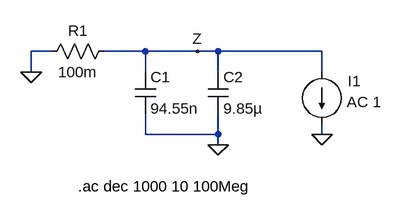
[diagram p0: schematic Draft1.asc]
Draft1.asc, the LTspice schematic file:
Version 4
SHEET 1 1128 680
WIRE -16 128 -48 128
WIRE 128 128 64 128
WIRE 208 128 128 128
WIRE 240 128 208 128
WIRE 400 128 240 128
WIRE -48 160 -48 128
WIRE 128 160 128 128
WIRE 240 160 240 128
WIRE 400 160 400 128
WIRE 128 256 128 224
WIRE 240 256 240 224
WIRE 240 256 128 256
WIRE 400 256 400 240
WIRE 240 272 240 256
FLAG 240 272 0
FLAG 208 128 Z
FLAG 400 256 0
FLAG -48 160 0
SYMBOL cap 112 160 R0
SYMATTR InstName C1
SYMATTR Value 94.55n
SYMATTR SpiceLine Rser=25.1m Lser=381p
SYMBOL cap 224 160 R0
SYMATTR InstName C2
SYMATTR Value 9.85µ
SYMATTR SpiceLine Rser=3m Lser=1.2n
SYMBOL current 400 160 R0
WINDOW 0 40 14 Left 2
WINDOW 3 38 46 Left 2
SYMATTR InstName I1
SYMATTR Value AC 1
SYMBOL res 80 112 R90
WINDOW 0 0 56 VBottom 2
WINDOW 3 32 56 VTop 2
SYMATTR InstName R1
SYMATTR Value 100m
TEXT 24 336 Left 2 !.ac dec 1000 10 100Meg

The netlist it stands for:
* Draft1.asc
C1 Z 0 94.55n Rser=25.1m Lser=381p
C2 Z 0 9.85µ Rser=3m Lser=1.2n
I1 Z 0 AC 1
R1 Z 0 100m
.ac dec 1000 10 100Meg
.backanno
.end